# EAGLE design Relay_Board_V2 (EAGLE 7.7.0)
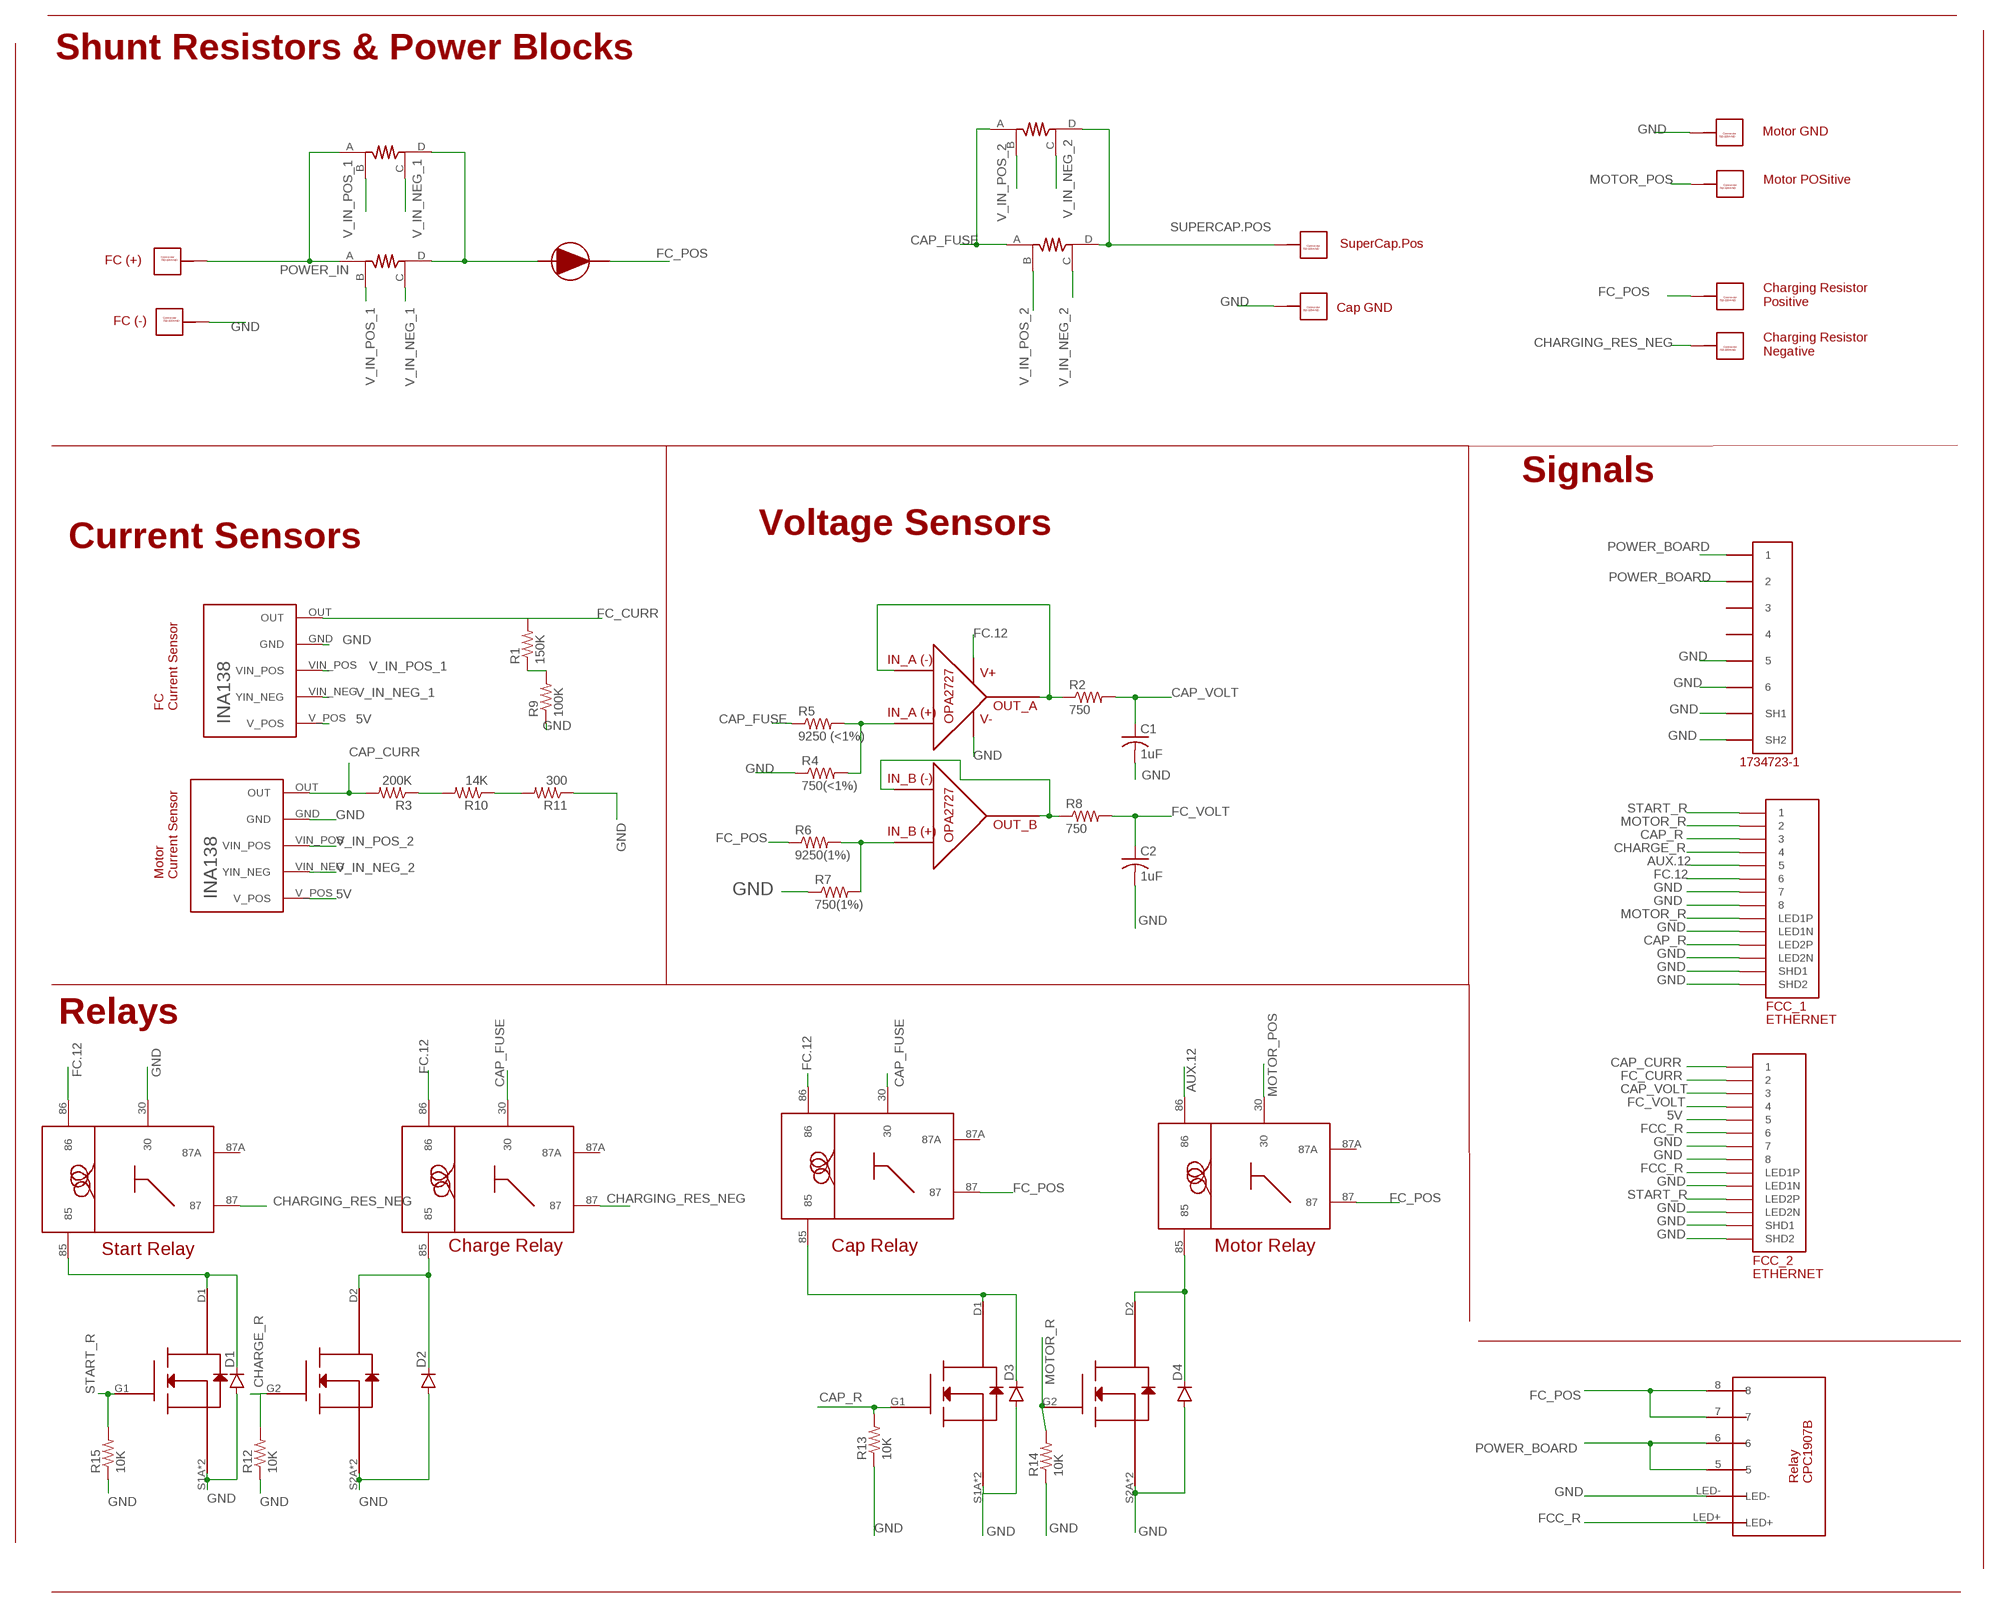
[diagram p0: schematic, sheet 1]

## Parts
C1  1uF  C-USC0805  [C0805]
C2  1uF  C-USC0805  [C0805]
CAP.GND  732-3204-ND_CONNECTOR  [732-3204-ND]
CAP.POS  732-3204-ND_CONNECTOR  [732-3204-ND]
CAP.RELAY  VCF4-1000  [VCF4-1000]
CAP.SHUNT.1  SHUNT_RESISTOR_CSM3637  [CSM3637]
CAP.SHUNT.2  SHUNT_RESISTOR_CSM3637  [CSM3637]
CHARGE_RELAY  VCF4-1000  [VCF4-1000]
D1  DIODESOD123  [SOD-123]
D2  DIODESOD123  [SOD-123]
D3  DIODESOD123  [SOD-123]
D4  DIODESOD123  [SOD-123]
FC.CURR.SENSOR  TI_INA138  [TI_INA138]
FC.GND  732-3204-ND_CONNECTOR  [732-3204-ND]
FC.POS  732-3204-ND_CONNECTOR  [732-3204-ND]
FC.SHUNT.1  SHUNT_RESISTOR_CSM3637  [CSM3637]
FC.SHUNT.2  SHUNT_RESISTOR_CSM3637  [CSM3637]
FC_DIODE  DIODE-APT60S20BG  [DIODE-APT60S20BG]
FCC_1  ETHERNET  [A122645-ND]
FCC_2  ETHERNET  [A122645-ND]
MOTOR.CURR.SENSOR  TI_INA138  [TI_INA138]
MOTOR.GROUND  732-3204-ND_CONNECTOR  [732-3204-ND]
MOTOR.POSITIVE  732-3204-ND_CONNECTOR  [732-3204-ND]
MOTOR.RELAY  VCF4-1000  [VCF4-1000]
R1  150K  R-US_R0805  [R0805]
R2  750  R-US_R0805  [R0805]
R3  200K  R-US_R0805  [R0805]
R4  750(<1%)  R-US_R0805  [R0805]
R5  9250 (<1%)  R-US_R0805  [R0805]
R6  9250(1%)  R-US_R0805  [R0805]
R7  750(1%)  R-US_R0805  [R0805]
R8  750  R-US_R0805  [R0805]
R9  100K  R-US_R0805  [R0805]
R10  14K  R-US_R0805  [R0805]
R11  300  R-US_R0805  [R0805]
R12  10K  R-US_R0805  [R0805]
R13  10K  R-US_R0805  [R0805]
R14  10K  R-US_R0805  [R0805]
R15  10K  R-US_R0805  [R0805]
RES.NEG  732-3204-ND_CONNECTOR  [732-3204-ND]
RES.POS  732-3204-ND_CONNECTOR  [732-3204-ND]
START.RELAY  VCF4-1000  [VCF4-1000]
U$9  SI6926ADQ-T1-E3CT-ND_MOSFET  [SI6926ADQ-T1-E3CT-ND_MOSFET]
U$17  OP-AMP_OPA2727AIDR  [OP-AMP_OPA2727AIDR]
U$19  5555140-6  [1734723-1_RJ11]
U$22  RELAY-CPC1907B  [RELAY-CPC1907B]
U$25  SI6926ADQ-T1-E3CT-ND_MOSFET  [SI6926ADQ-T1-E3CT-ND_MOSFET]

## Nets
5V: FC.CURR.SENSOR.V_POS FCC_2.P$5 MOTOR.CURR.SENSOR.V_POS
AUX.12: FCC_1.P$5 MOTOR.RELAY.86
CAP_CURR: FCC_2.P$1 MOTOR.CURR.SENSOR.OUT R3.2
CAP_FUSE: CAP.RELAY.30 CAP.SHUNT.1.A CAP.SHUNT.2.A CHARGE_RELAY.30 R5.1
CAP_R: FCC_1.P$3 FCC_1.P$12(LED2P) R13.2 U$9.G1
CAP_VOLT: C1.1 FCC_2.P$3 R2.2
CHARGE_R: FCC_1.P$4 R12.2 U$25.G2
CHARGING_RES_NEG: CHARGE_RELAY.87 RES.NEG.P$1 RES.NEG.P$2 RES.NEG.P$3 RES.NEG.P$4 RES.NEG.P$5 RES.NEG.P$6 RES.NEG.P$7 RES.NEG.P$8 RES.NEG.P$9 RES.NEG.P$10 START.RELAY.87
FC.12: CAP.RELAY.86 CHARGE_RELAY.86 FCC_1.P$6 START.RELAY.86 U$17.V+
FC_CURR: FC.CURR.SENSOR.OUT FCC_2.P$2 R1.2
FC_POS: CAP.RELAY.87 FC_DIODE.CATHODE MOTOR.RELAY.87 R6.1 RES.POS.P$1 RES.POS.P$2 RES.POS.P$3 RES.POS.P$4 RES.POS.P$5 RES.POS.P$6 RES.POS.P$7 RES.POS.P$8 RES.POS.P$9 RES.POS.P$10 U$22.7 U$22.8
FC_VOLT: C2.1 FCC_2.P$4 R8.2
FCC_R: FCC_2.P$6 FCC_2.P$10(LED1P) U$22.LED+
GND: C1.2 C2.2 CAP.GND.P$1 CAP.GND.P$2 CAP.GND.P$3 CAP.GND.P$4 CAP.GND.P$5 CAP.GND.P$6 CAP.GND.P$7 CAP.GND.P$8 CAP.GND.P$9 CAP.GND.P$10 D1.A D2.A D3.A D4.A FC.CURR.SENSOR.GND FC.GND.P$1 FC.GND.P$2 FC.GND.P$3 FC.GND.P$4 FC.GND.P$5 FC.GND.P$6 FC.GND.P$7 FC.GND.P$8 FC.GND.P$9 FC.GND.P$10 FCC_1.P$7 FCC_1.P$8 FCC_1.P$9(LED1N) FCC_1.P$11(LED2N) FCC_1.P$13(SHD1) FCC_1.P$14(SHD2) FCC_2.P$7 FCC_2.P$8 FCC_2.P$9(LED1N) FCC_2.P$11(LED2N) FCC_2.P$13(SHD1) FCC_2.P$14(SHD2) MOTOR.CURR.SENSOR.GND MOTOR.GROUND.P$1 MOTOR.GROUND.P$2 MOTOR.GROUND.P$3 MOTOR.GROUND.P$4 MOTOR.GROUND.P$5 MOTOR.GROUND.P$6 MOTOR.GROUND.P$7 MOTOR.GROUND.P$8 MOTOR.GROUND.P$9 MOTOR.GROUND.P$10 R4.1 R7.1 R9.1 R11.1 R12.1 R13.1 R14.1 R15.1 START.RELAY.30 U$9.S1A(S1) U$9.S1B(S1) U$9.S2A(S2) U$9.S2B(S2) U$17.V- U$19.5 U$19.6 U$19.SH1 U$19.SH2 U$22.LED- U$25.S1A(S1) U$25.S1B(S1) U$25.S2A(S2) U$25.S2B(S2)
MOTOR_POS: MOTOR.POSITIVE.P$1 MOTOR.POSITIVE.P$2 MOTOR.POSITIVE.P$3 MOTOR.POSITIVE.P$4 MOTOR.POSITIVE.P$5 MOTOR.POSITIVE.P$6 MOTOR.POSITIVE.P$7 MOTOR.POSITIVE.P$8 MOTOR.POSITIVE.P$9 MOTOR.POSITIVE.P$10 MOTOR.RELAY.30
MOTOR_R: FCC_1.P$2 FCC_1.P$10(LED1P) R14.2 U$9.G2
N$1: R1.1 R9.2
N$3: CAP.RELAY.85 D3.C U$9.D1
N$5: D1.C START.RELAY.85 U$25.D1
N$7: CHARGE_RELAY.85 D2.C U$25.D2
N$9: R4.2 R5.2 U$17.IN_A+
N$10: R6.2 R7.2 U$17.IN_B+
N$11: R8.1 U$17.IN_B- U$17.OUT_B
N$12: R2.1 U$17.IN_A- U$17.OUT_A
N$25: R3.1 R10.2
N$26: R10.1 R11.2
N$29: D4.C MOTOR.RELAY.85 U$9.D2
POWER_BOARD: U$19.1 U$19.2 U$22.5 U$22.6
POWER_IN: FC.POS.P$1 FC.POS.P$2 FC.POS.P$3 FC.POS.P$4 FC.POS.P$5 FC.POS.P$6 FC.POS.P$7 FC.POS.P$8 FC.POS.P$9 FC.POS.P$10 FC.SHUNT.1.A FC.SHUNT.2.A
SHUNT_RES_1: FC.SHUNT.1.D FC.SHUNT.2.D FC_DIODE.ANODE
START_R: FCC_1.P$1 FCC_2.P$12(LED2P) R15.2 U$25.G1
SUPERCAP.POS: CAP.POS.P$1 CAP.POS.P$2 CAP.POS.P$3 CAP.POS.P$4 CAP.POS.P$5 CAP.POS.P$6 CAP.POS.P$7 CAP.POS.P$8 CAP.POS.P$9 CAP.POS.P$10 CAP.SHUNT.1.D CAP.SHUNT.2.D
V_IN_NEG_1: FC.CURR.SENSOR.VIN_NEG(YIN_NEG) FC.SHUNT.1.C FC.SHUNT.2.C
V_IN_NEG_2: CAP.SHUNT.1.C CAP.SHUNT.2.C MOTOR.CURR.SENSOR.VIN_NEG(YIN_NEG)
V_IN_POS_1: FC.CURR.SENSOR.VIN_POS FC.SHUNT.1.B FC.SHUNT.2.B
V_IN_POS_2: CAP.SHUNT.1.B CAP.SHUNT.2.B MOTOR.CURR.SENSOR.VIN_POS
Unconnected: CAP.RELAY.87A CHARGE_RELAY.87A MOTOR.RELAY.87A START.RELAY.87A U$19.3 U$19.4

## Notes on the sheet
- Shunt Resistors & Power Blocks
- Motor GND
- Motor POSitive
- SuperCap.Pos
- FC (+)
- Cap GND
- Charging Resistor
  Positive
- FC (-)
- Charging Resistor
  Negative
- Signals
- Voltage Sensors
- Current Sensors
- FC
  Current Sensor
- Motor
  Current Sensor
- Relays
- Start Relay | Charge Relay | Cap Relay | Motor Relay

## Library data of the parts
C1 C2 = rcl:C-US: CAPACITOR, American symbol
CAP.GND CAP.POS FC.GND FC.POS MOTOR.GROUND MOTOR.POSITIVE RES.NEG RES.POS = Connector 732-3204:732-3204-ND_CONNECTOR
CAP.RELAY CHARGE_RELAY MOTOR.RELAY START.RELAY = VCF4-1000:VCF4-1000: Part for the VCF4-1000 relay socket. Digi-Key Part Number: PB232-ND. Pin numbering is directly taken from the data sheet of the relay. Relay Digi-Key Part Number: 255-2083-ND (Also works with 255-1825-ND). If using relay 255-1825-ND, ignore pin 87A.
CAP.SHUNT.1 CAP.SHUNT.2 FC.SHUNT.1 FC.SHUNT.2 = Vishay_Shunt_Resistor_CSM3637:SHUNT_RESISTOR_CSM3637: Vishay Shunt Resistor CSM3637, 2-200 mOmh's Digikey Number: Y1488-.002BTR-ND; RESISTANCE: 2 - 200 mOhm's
D1-D4 = SparkFun-DiscreteSemi:DIODE: Diode These are standard reverse protection diodes and small signal diodes. SMA package can handle up to about 1A. SOD-323 can handle about 200mA. What the SOD-323 package when ordering, there are some mfgs out there that are 5-pin packages.
FC.CURR.SENSOR MOTOR.CURR.SENSOR = TI_INA138:TI_INA138: Texas Instruments INA138. Datasheet: http://www.ti.com/lit/ds/symlink/ina138.pdf
FC_DIODE = Diode_APT60S20BG-ND:DIODE-APT60S20BG
FCC_1 FCC_2 = ETHERNET-3:ETHERNET: Ethernet port with 2 leds. digikey number A122645-ND
R1-R15 = resistor:R-US_: RESISTOR, American symbol
U$9 U$25 = MOSFET Si6926ADQ:SI6926ADQ-T1-E3CT-ND_MOSFET
U$17 = OP_AMP_OPA2727AIDR:OP-AMP_OPA2727AIDR
U$19 = 5555140-6 RJ11:5555140-6
U$22 = Relay_CPC1907B:RELAY-CPC1907B

## Board
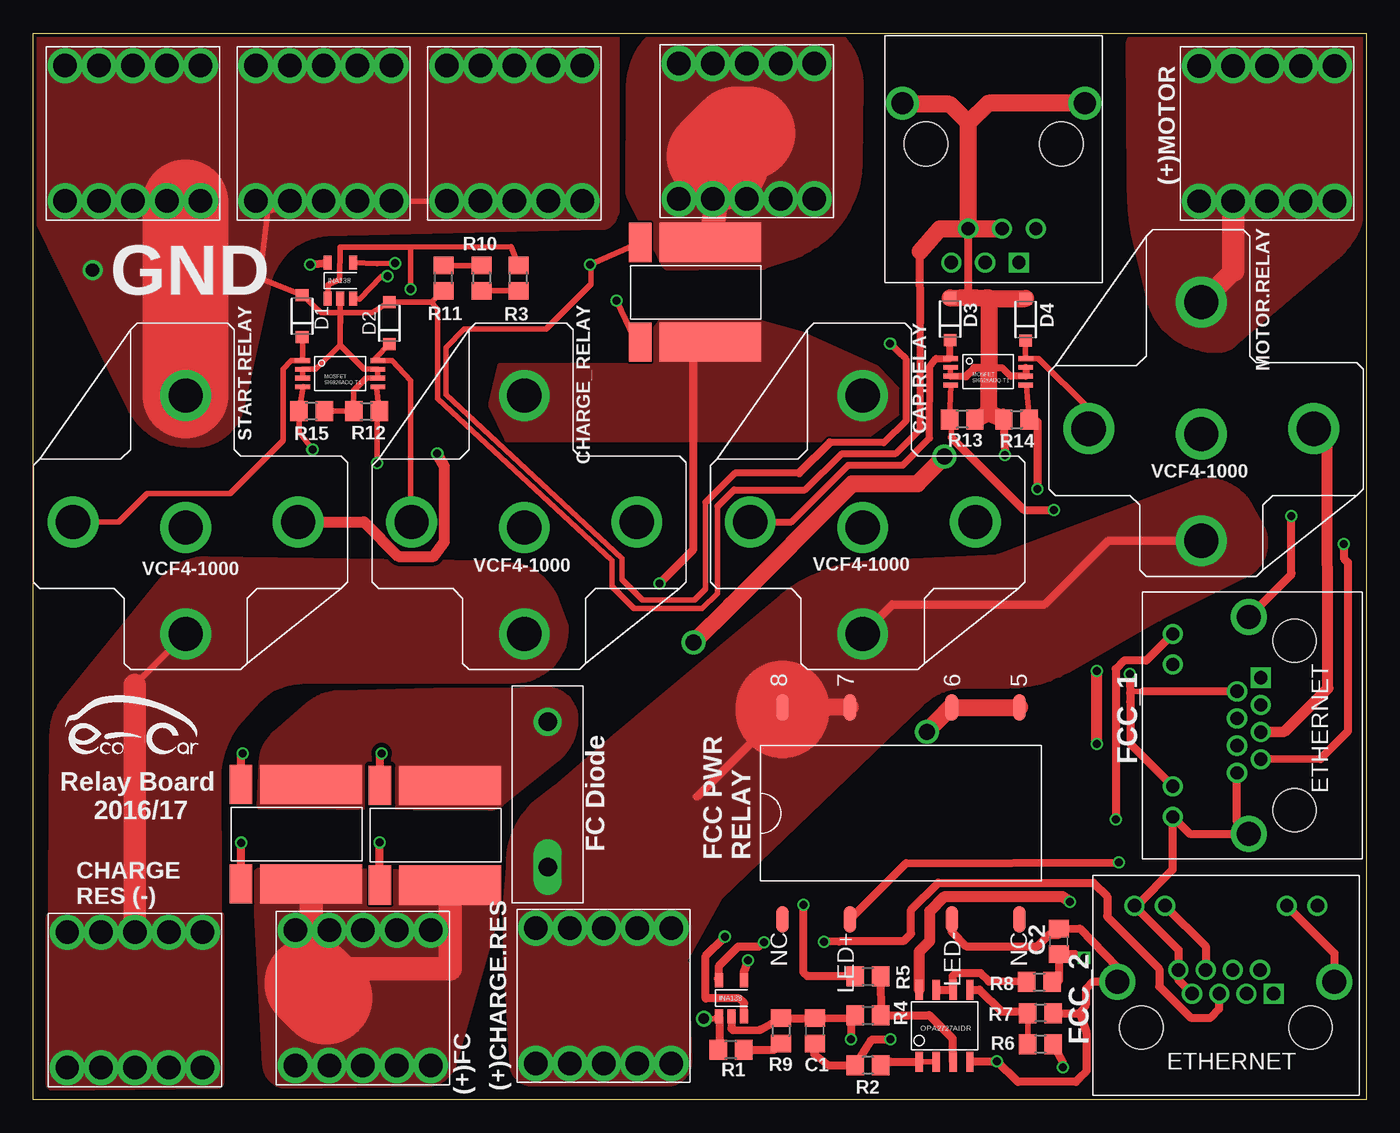
[diagram p1: board, top side]
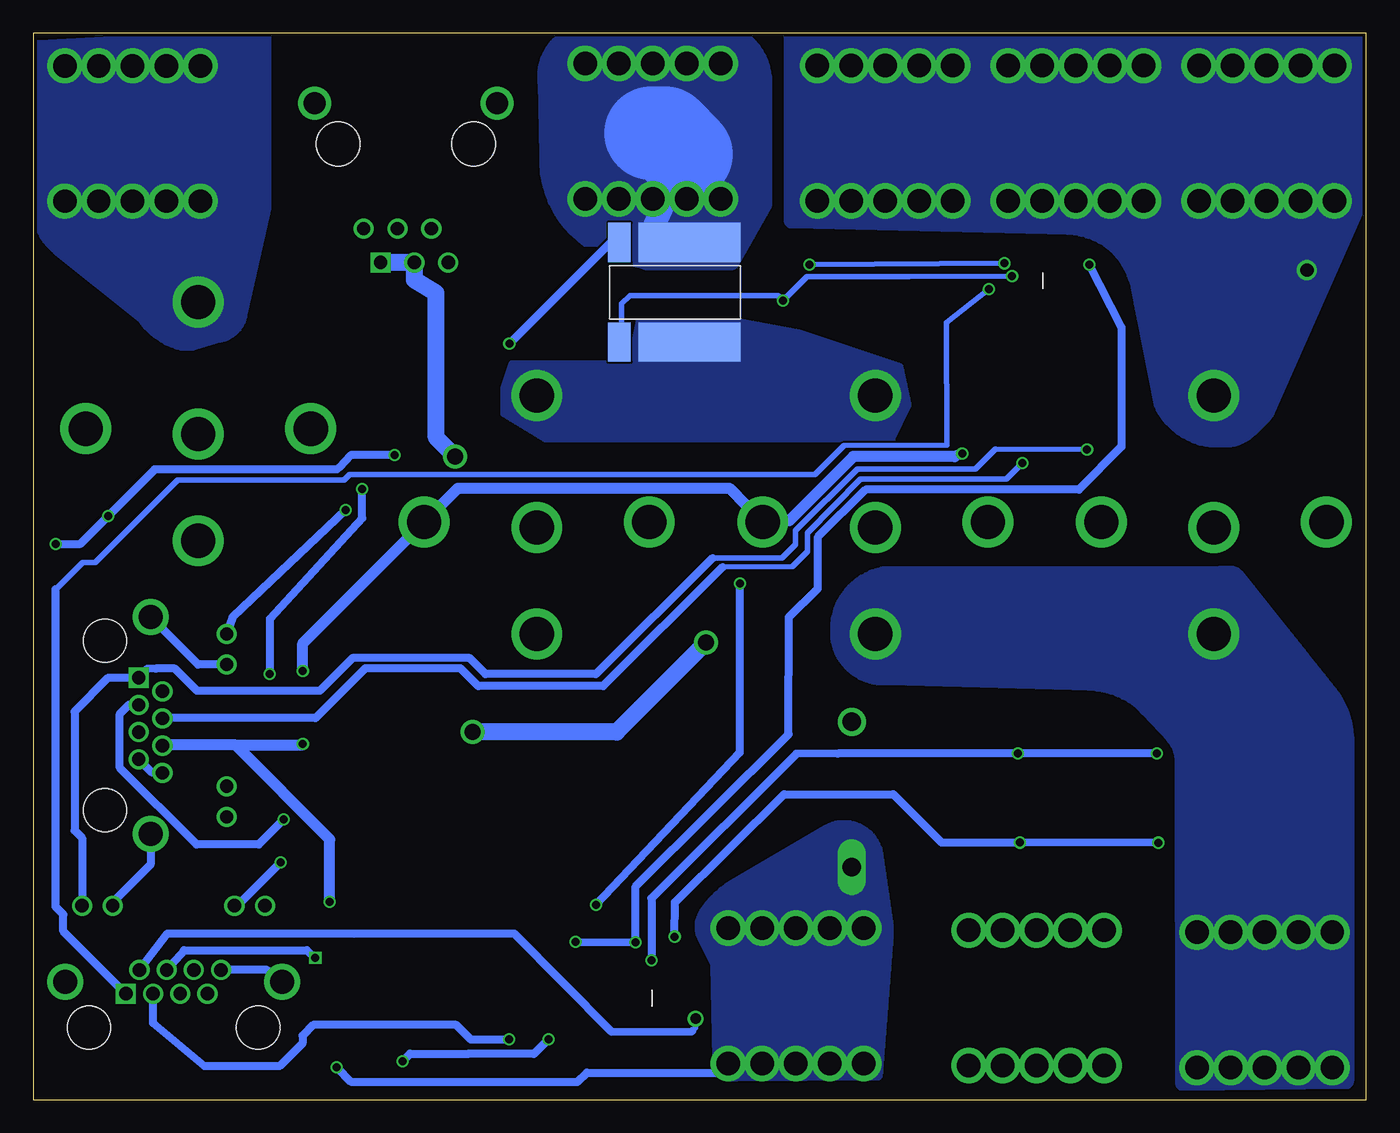
[diagram p2: board, bottom side, seen from below]

Size 100 x 80 mm. Coordinates in mm from the lower left corner, seen from the top.
Outline: 0,0 0,80 100,80 100,0 0,0
Copper layers (1*16): Top 0.035mm / dielectric 1.5mm / Bottom 0.035mm
Design rules "SeeedStudio_2layer_DRU_no_angle_20140221": minimum track width 6mil, minimum drill 12mil, track to track 6mil, track to pad 6mil, pad to pad 6mil, via to via 6mil, smd to smd 0mil, copper to edge 10mil, drill to drill 10mil, minimum pad ring 10mil, minimum via ring 6mil, stop-mask expansion 2mil, vias tented up to drill 100mil, thermal gap 10mil

### Footprints (pad centres in the part's own frame; a part is rotated, then mirrored left to right if it is on the bottom)
C0805 = smd 1.3 x 1.5: 1 -0.95,0; 2 0.95,0
732-3204-ND = drill 1.76: P$1 -5.08,5.08; P$2 -2.54,5.08; P$3 0,5.08; P$4 2.54,5.08; P$5 5.08,5.08; P$6 5.08,-5.08; P$7 2.54,-5.08; P$8 0,-5.08; P$9 -2.54,-5.08; P$10 -5.08,-5.08
VCF4-1000 = drill 2.57 pad 3.81: 30 -17.9,0; 85 -8.407,-8.445; 86 -8.407,8.445; 87 0,0; 87A -8,0
CSM3637 = smd 2.95 x 7.62: A -3.735,0; D 3.735,0 | smd 2.95 x 1.68: B -3.735,5.26; C 3.735,5.26
SOD-123 = smd 0.9 x 0.95: A 1.575,0; C -1.575,0
TI_INA138 = smd 1.05 x 0.6: GND 0,0; OUT 0,0.95; V_POS 2.7,0.95; VIN_NEG 2.7,-0.95; VIN_POS 0,-0.95
DIODE-APT60S20BG = drill 1.4: ANODE 5.45,0 | drill 1.4 long: CATHODE -5.45,0
A122645-ND = drill 1 square: P$1 3.58,2.54 | drill 1: P$2 2.56,4.32; P$3 1.54,2.54; P$4 0.52,4.32; P$5 -0.5,2.54; P$6 -1.52,4.32; P$7 -2.54,2.54; P$8 -3.56,4.32; P$9 -6.86,9.14; P$10 -4.57,9.14; P$11 4.57,9.14; P$12 6.86,9.14 | drill 1.8: P$13 -8.13,3.43; P$14 8.13,3.43 | hole 3.25: -6.35,0; 6.35,0
R0805 = smd 1.3 x 1.5: 1 -0.95,0; 2 0.95,0
SI6926ADQ-T1-E3CT-ND_MOSFET = smd 1.1 x 0.356: D1 -2.82,0.992; D2 2.82,0.992; G1 -2.82,-0.992; G2 2.82,-0.992; S1A -2.82,0.331; S1B -2.82,-0.331; S2A 2.82,0.331; S2B 2.82,-0.331
OP-AMP_OPA2727AIDR = smd 1.5 x 0.55: IN_A+ -2.7,-0.635; IN_A- -2.7,0.635; IN_B+ 2.7,-1.905; IN_B- 2.7,-0.635; OUT_A -2.7,1.905; OUT_B 2.7,0.635; V+ 2.7,1.905; V- -2.7,-1.905
1734723-1_RJ11 = drill 1 square: 1 -2.54,2.54 | drill 1: 2 0,2.54; 3 2.54,2.54; 4 -3.81,0; 5 -1.27,0; 6 1.27,0 | drill 1.65: SH1 -7.5,-9.4; SH2 6.22,-9.4 | hole 3.3: -5.72,-6.35; 4.44,-6.35
RELAY-CPC1907B = smd 2 x 0.95: 5 7.95,-8.891; 6 7.95,-3.809; 7 7.95,3.811; 8 7.95,8.891; LED+ -7.95,3.811; LED- -7.95,-3.811; NC_1 -7.95,8.891; NC_2 -7.95,-8.891

### Placement (x,y rotation side)
C1  58.63,5.16 90 top
C2  76.93,11.86 90 top
CAP.GND  21.78,72.5 0 top
CAP.POS  53.52,72.65 0 top
CAP.RELAY  62.23,34.92 270 top
CAP.SHUNT.1  50.8,60.57 90 top
CAP.SHUNT.2  50.77,60.57 90 bottom
CHARGE_RELAY  36.83,34.92 270 top
D1  20.17,58.77 90 top
D2  26.71,58.24 90 top
D3  68.79,58.56 90 top
D4  74.44,58.52 90 top
FC.CURR.SENSOR  52.38,6.24 90 top
FC.GND  7.47,72.5 0 top
FC.POS  24.74,7.62 0 top
FC.SHUNT.1  31.27,19.83 90 top
FC.SHUNT.2  20.85,19.91 90 top
FC_DIODE  38.59,22.89 90 top
FCC_1  94.63,28.07 90 top
FCC_2  89.48,5.4 0 top
MOTOR.CURR.SENSOR  23.03,60.08 90 top
MOTOR.GROUND  36.09,72.5 0 top
MOTOR.POSITIVE  92.55,72.49 0 top
MOTOR.RELAY  87.63,41.93 270 top
R1  52.34,3.72 180 top
R2  62.62,2.57 180 top
R3  36.39,61.64 90 top
R4  62.62,6.33 0 top
R5  62.62,9.24 0 top
R6  75.55,4.15 180 top
R7  75.55,6.49 180 top
R8  75.48,8.82 0 top
R9  56.09,5.16 270 top
R10  33.62,61.64 270 top
R11  30.77,61.64 90 top
R12  25,51.64 0 top
R13  69.7,51.04 180 top
R14  73.76,51.03 0 top
R15  20.88,51.64 180 top
RES.NEG  7.62,7.47 0 top
RES.POS  42.78,7.78 0 top
START.RELAY  11.43,34.92 270 top
U$9  71.64,54.61 0 top
U$16  [LOGO]  7.78,27.71 0 top
U$17  68.37,5.54 90 top
U$19  71.41,65.34 180 top
U$22  65.09,21.48 90 top
U$25  23.03,54.46 0 top

### Tracks (layer width: path | path; a pad name or v marks a point on that pad's centre or on a via)
5V  (via drill 0.6)
  Top 0.406: 51.27,9.1 51.4,8.97 FC.CURR.SENSOR.V_POS | 80.57,13.75 80.59,13.69
  Top 0.61: 51.4,8.97 51.41,9.98 52.88,11.47 54.42,11.47 v54.83,11.79 | FCC_2.P$5 88.98,6.79 88.33,6.14 86.84,6.14 84.48,8.49 84.48,9.8 80.59,13.69 | 80.57,13.75 80.57,15.24 79.54,16.27 67.9,16.27 65.85,14.22 65.85,12.44 65.28,11.87 60.48,11.86 v59.31,11.84 | v20.78,62.66 MOTOR.CURR.SENSOR.V_POS
  Bottom 0.61: v20.78,62.66 18.35,57.94 18.35,48.99 21.55,45.77 37.56,45.77 41.12,42.24 41.14,38.33 43.31,36.2 43.33,27.41 54.81,15.98 v54.83,11.79 v59.31,11.84
AUX.12
  Top 0.406: FCC_1.P$5 92.5,27.57
  Top 0.813: FCC_1.P$5 93.88,27.62 97.12,30.86 97.08,49.2 MOTOR.RELAY.86
CAP_CURR  (via drill 0.6)
  Top 0.406: R3.2 35.84,63.98 28.31,63.96 | MOTOR.CURR.SENSOR.OUT 22.11,61.14 22.98,61.53 23,63.95 28.31,63.96 | 28.31,63.96 v28.31,60.8
  Bottom 0.406: 98.32,38.27 96.3,40.29 95.37,40.29 89.19,46.48 89.19,46.5 76.67,46.5 76.28,46.89 74.49,46.89 74.03,46.9 41.35,46.91 39.18,49.08 31.46,49.09 31.49,58.28 v28.31,60.8
  Bottom 0.61: 98.32,38.27 98.32,14.47 97.74,13.88 97.74,12.62 FCC_2.P$1
CAP_FUSE  (via drill 0.6)
  Top 0.406: 49.53,55.57 CAP.SHUNT.1.A
  Top 0.61: R5.1 58.07,9.24 57.78,9.53 v57.78,14.61 | v46.99,38.73 49.53,41.27 49.53,55.57
  Bottom 0.61: v57.78,14.61 46.99,26.04 v46.99,38.73
  pour Bottom (no thermals): 46.99,58.42 42.57,57.58 34.95,55.04 34.29,52.07 35.56,49.53 61.59,49.53 64.77,51.44 64.77,53.34 64.14,55.24 55.24,55.24 54.61,58.42
  pour Top (no thermals): 54.46,58.34 57.56,57.48 63.3,54.86 64.77,53.34 64.77,51.44 62.23,49.53 35.56,49.53 34.29,52.07 35.03,55.07 44.55,55.07 47.07,58.32
CAP_R  (via drill 0.6)
  Top 0.406: U$9.G1 68.85,53.59 R13.2 68.89,51.62 68.89,49.69
  Top 0.61: v76.57,44.24 74.33,44.24 68.89,49.69 | FCC_1.P$12 83.5,32.93 81.83,32.93 81.21,32.31 v81.21,21
  Bottom 0.61: v76.57,44.24 85.05,36.2 FCC_1.P$12 | v81.21,21 83.08,19.14 87.74,19.14 93.5,24.89 93.5,28.94 92.83,29.61 FCC_1.P$3
CAP_VOLT  (via drill 0.6)
  Top 0.61: C1.1 58.59,3.41 59.65,2.57 R2.2 62.93,4.51 v64.32,4.51
  Bottom 0.61: FCC_2.P$3 91.02,5.73 87.16,2.5 81.52,2.5 79.81,4.21 79.81,4.79 79,5.6 68.27,5.6 67.18,4.51 v64.32,4.51
CHARGE_R  (via drill 0.6)
  Top 0.406: U$25.G2 25.75,53.37 R12.2 25.78,51.55 25.78,49.33 v25.78,47.76
  Bottom 0.406: 48.28,39.95 43.05,39.98 41.91,41.12 41.91,42.52 37.93,46.54 27,46.54 v25.78,47.76 | 90.29,28.61 FCC_1.P$4
  Bottom 0.61: 48.28,39.95 57.25,31.02 66.62,31.02 67.95,32.35 75.1,32.35 78.83,28.61 90.29,28.61
CHARGING_RES_NEG
  Top 0.406: START.RELAY.87 7.62,31.12
  Top 1.676: 7.62,31.12 RES.NEG.P$3
  pour Top (no thermals): 13.69,13.69 13.69,1.4 1.56,1.24 1.56,13.54
  pour Top (isolate 0.305, rank 2, no thermals): 39.28,37.29 arc61 36.26,40.08 34.24,40.27 13.03,40.57 arc52 9.6,38.96 2.42,30.14 arc39 1.39,27.27 1.27,10.16 13.97,8.26 13.9,24.15 arc-42 15.57,28.5 16.83,29.89 arc-48 20.09,31.35 36.12,31.41 arc92 39.98,35.48
  pour Bottom (no thermals): 39.58,35.37 arc78 36.2,39.38 10.82,39.44 arc52 9.8,39.28 2.79,30.48 arc39 1.55,26.95 1.55,1.4 13.68,1.24 13.71,25.38 arc-42 14.45,27.27 16.29,29.29 arc-46 20.68,31.29 35.83,31.7 arc101
FC.12  (via drill 0.6)
  Top 0.813: U$17.V+ 66.46,11.1 67.26,11.9 67.26,14.13 68.37,15.24 77.21,15.24 v77.78,14.85 | v79.78,26.67 v79.78,32.15 | START.RELAY.86 24.81,43.33 27.38,40.76 30.04,40.76 30.86,41.86 30.86,47.49 v30.31,48.48
  Bottom 0.406: 90.27,26.59 FCC_1.P$6 | 79.86,26.59 v79.78,26.67 | 45.28,43.35 CHARGE_RELAY.86
  Bottom 0.813: v77.78,14.85 77.76,19.52 84.83,26.59 | 84.83,26.59 90.27,26.59 | 84.83,26.59 79.86,26.59 | v79.78,32.15 79.78,34.23 CAP.RELAY.86 68.13,45.88 47.78,45.88 CHARGE_RELAY.86 | v30.31,48.48 30.89,48.23 38.48,48.25 43.28,43.43 45.28,43.35
FC_CURR  (via drill 0.8)
  Top 0.406: 51.47,6.22 51.47,6.21 51.24,6.21 FC.CURR.SENSOR.OUT 51.25,6.07 v50.31,6.07 | 51.47,4.03 R1.2
  Top 0.61: 51.47,6.22 51.47,4.03
  Bottom 0.406: 89.3,12.46 89.3,12.45 | 50.56,5.13 50.31,5.39 v50.31,6.07
  Bottom 0.61: FCC_2.P$2 89.94,12.46 89.3,12.46 | 89.3,12.45 74.81,12.45 75.92,12.45 63.91,12.45 56.62,5.08 50.56,5.13
FC_POS  (via drill 0.6)
  Top 0.406: 77.23,2.79 v77.23,2.41
  Top 0.61: CAP.RELAY.87 64.45,37.15 75.88,37.15 80.66,41.93 MOTOR.RELAY.87 | R6.1 77.23,2.79 | 56.2,29.13 49.78,22.71
  Top 1.27: U$22.7 U$22.8
  Top 7: U$22.8 56.2,29.13
  Bottom 0.406: 48.54,2.02 RES.POS.P$6
  Bottom 0.61: 48.54,2.02 58.47,2.02 59.17,1.32 70.68,1.32 76.19,1.34 v77.23,2.41
  pour Top (rank 4, no thermals): 48.9,10.16 49.11,2.87 arc-92 47.54,1.24 37.5,1.24 arc-87 36.01,2.65 35.56,10.79 35.56,14.61 35.76,17.42 arc-48 37.62,22.07 39.27,23.35 43.72,27.19 56.24,37.65 arc-37 62.72,40.18 72.39,40.64 86.91,46.12 arc-81 91.14,44.58 92.01,43.03 arc-93 90.89,39.41 84.45,36.2 77.66,32.31 arc-30 73.15,31.11 69.89,31.11 arc44 66.54,29.76 51.44,15.24 48.6,10.12
  pour Bottom (no thermals): 36.61,1.71 47.31,1.64 arc89 48.73,3.01 48.9,10.16 49.82,11.98 arc60 49.7,14.16 arc26 47.49,16.26 40.51,20.33 arc112 36.56,18.42 35.74,12.75
FC_VOLT  (via drill 0.6)
  Top 0.406: 76.93,8.87 R8.2
  Top 0.61: 76.93,8.87 C2.1 78.15,10.93 v78.84,10.63
  Bottom 0.61: FCC_2.P$4 88.68,11.2 79.46,11.2 v78.84,10.63
FCC_R  (via drill 0.6)
  Top 0.61: U$22.LED+ 65.48,17.72 v81.43,17.8 | FCC_2.P$10 87.96,11.49 FCC_2.P$6
  Bottom 0.406: 84.71,14.54 FCC_2.P$10
  Bottom 0.61: v81.43,17.8 84.71,14.54
GND  (via drill 0.6, 1)
  Top 0.406: MOTOR.CURR.SENSOR.GND 23.02,60.09 23.02,59.48 | 23.02,58.32 23.05,58.3 23.02,59.48 | R12.1 24.05,53.21 24.96,54.12 25.84,54.12 U$25.S2B U$25.S2A 24.83,54.79 23.02,56.61 | U$25.S1B U$25.S1A 21.2,54.79 23.02,56.61 | 23.02,56.61 23.02,58.32 | 23.02,58.32 23.02,59.05 | 23.02,59.05 23.02,59.48 | MOTOR.GROUND.P$10 20.3,67.42 17.6,66.62 16.96,61.65 D1.A 21.59,59.05 23.02,59.05 | 24.03,51.56 R12.1 | U$9.S1A U$9.S1B | 72.79,51.67 R14.1 72.81,50.35 | 71.67,51.51 71.69,51.55 | U$9.S2B | 58.68,6.1 C1.2 | 61.47,6.12 R4.1 61.35,6.2 | R7.1 78.51,6.51 | 81.47,8.86 FCC_2.P$13 | 76.96,12.36 C2.2 | v72.31,2.87 72.04,2.82 | 52.38,5.32 52.48,5.21 | 82.78,14.54 FCC_2.P$9 | 51.34,44.49 51.34,37.99 50.18,36.83 45.09,36.83 43.41,38.51 43.41,40.45 30.34,52.58 30.34,59.32 29.84,59.82 | 70.16,65.34 U$19.6 | 71.49,60.13 71.69,60.13 71.72,60.1 | 65.19,74.68 U$19.SH2 | 94.39,39.5 94.34,39.34 | R15.1 R12.1 | 23.02,59.05 25.4,59.05 D2.A 29.84,59.82 | 29.84,59.82 29.9,59.82 R11.1 | 78.53,1.63
  Top 0.508: U$9.S2A U$9.S2B | U$9.S1B 69.98,54.27 | U$9.S2B 73.32,54.27 72.7,54.9 71.69,54.9 | 51.34,44.49 52.58,45.74 57.89,45.74 60.68,48.46 64.72,48.48 66.55,50.29 66.55,58.32
  Top 0.61: 69.98,54.27 70.6,54.9 71.69,54.9 | 52.48,5.21 54.55,5.24 R9.1 58.68,6.1 | C1.2 61.47,6.12 | 78.51,6.51 79,5.03 79,2.1 78.53,1.63 78.22,1.32 73.87,1.32 v72.31,2.87 | R7.1 78.51,6.46 79,7.15 79,8.32 79.54,8.86 81.47,8.86 | U$22.LED- 68.9,12.59 69.98,11.51 75.34,11.51 76.2,12.36 76.96,12.36 | 72.04,2.82 U$17.V- | C2.2 78.51,12.82 81.35,9.94 FCC_2.P$13 | 72.81,50.35 v72.88,48.36 | FCC_1.P$14 94.34,39.34 | 94.39,39.5 v94.39,43.78 | FC.CURR.SENSOR.GND 52.38,5.32 | FCC_1.P$7 96.57,25.55 98.64,27.63 98.64,40.29 98.32,40.6 v98.32,41.69 | FCC_1.P$8 90.31,20.83 FCC_1.P$13 86.76,19.94 FCC_1.P$9 85.49,17.26 82.78,14.54 | FCC_2.P$11 97.61,10.98 FCC_2.P$14 | FCC_2.P$9 85.92,11.24 FCC_2.P$8 85.92,8.96 FCC_2.P$7 | 61.35,6.2 v61.35,4.51 | 70.14,60.22 U$19.6 | 66.55,58.32 66.52,63.63
  Top 1.27: R13.1 71.69,51.55 71.69,54.9 71.69,60.13 | R14.1 71.67,51.51 | D3.A 70.14,60.22 71.49,60.13 | U$19.5 70.16,65.34 70.16,73.28 | 71.72,60.1 D4.A | 66.52,63.63 68,65.34 U$19.6 | 70.16,73.28 68.76,74.68 65.19,74.68 | U$19.SH1 71.65,74.75 70.16,73.28
  Top 6.452: START.RELAY.30 11.43,67.31
  Bottom 0.406: 77.06,47.43 | 77.06,47.43 77.21,47.27 | 94.05,14.78 FCC_2.P$11
  Bottom 0.61: FCC_2.P$13 82.47,9.72 FCC_2.P$8 | FCC_1.P$8 91.07,24.51 FCC_1.P$7 | FCC_1.P$13 91.2,17.63 94.05,14.78 | v72.31,2.87 71.73,3.45 69.27,3.42 67.42,3.42 62.44,3.42 v61.35,4.51 | FCC_1.P$11 87.64,32.64 FCC_1.P$14 | v72.88,48.36 76.18,48.36 77.06,47.43 | 77.21,47.27 90.9,47.27 v94.39,43.78 96.48,41.69 v98.32,41.69
  other vias: 4.45,62.23
  pour Top (no thermals): 43.21,66.43 arc-86 42.64,65.87 21.97,65.39 arc77 17.15,61.01 15.19,51.96 arc-77 12.1,49.53 11.68,49.53 arc-64 7.65,52.03 0.13,67.23 -1.77,81.11 43.35,80.7 43.35,66.66
  pour Bottom (no thermals): 43.05,65.96 43.05,82.38 -0.89,80.47 -2.79,68.34 arc-131 0.16,68.29 7.62,51.44 8.69,50.36 arc45 10.7,49.53 11.13,49.53 arc63 15.24,52.07 17.03,61.02 arc-77 22.36,65.49
MOTOR_POS
  Top 1.422: MOTOR.RELAY.30 90.01,62.21
  Top 1.676: 90.01,62.21 MOTOR.POSITIVE.P$9
  pour Top (no thermals): 99.41,79.19 99.41,67.77 arc-53 97.2,63.29 89.62,56.86 arc-48 87.79,56.75 arc-74 84.04,60.71 83.23,64.03 arc-13 82.66,68.63 82.61,79.3
  pour Bottom (no thermals): 91.64,58.81 98.13,64.01 arc50 99.36,66.52 99.56,78.87 82.78,79.77 82.78,67.01 84.54,59.14 arc77 86.09,57.41 88.33,56.7 arc48
MOTOR_R  (via drill 0.6)
  Top 0.406: U$9.G2 74.51,53.57 R14.2 75.34,50.85 | 83.25,30.63 82.44,30.63 82.3,30.49
  Top 0.61: 75.34,50.85 v75.34,45.8 | FCC_1.P$2 83.25,30.63 | 82.3,30.49 82.3,29.84 | 82.3,29.84 82.3,26.69 FCC_1.P$10 | v82.27,31.92 82.3,29.84
  Bottom 0.61: v82.27,31.92 82.27,36.07 75.33,43.61 v75.34,45.8
N$1
  Top 0.61: R1.1 55.54,3.73 R9.2
N$3
  Top 0.406: U$9.D1 68.79,55.6
  Top 0.508: CAP.RELAY.85 56.87,43.33 61.14,47.61 65.23,47.61 67.24,49.62 67.27,54.98 67.72,55.59 U$9.D1 | 68.79,55.6 D3.C
N$5
  Top 0.406: START.RELAY.85 6.4,43.33 8.55,45.49 14.77,45.49 18.74,49.45 18.74,54.82 19.36,55.44 20.2,55.44 U$25.D1 20.21,57.16 D1.C
N$7
  Top 0.406: D2.C 25.67,55.62 U$25.D2 25.85,55.44 26.9,55.44 28.3,53.96 28.3,43.34 CHARGE_RELAY.85
N$9
  Top 0.406: 68.97,2.87 U$17.IN_A+ | 63.59,6.33 R4.2
  Top 0.61: 68.97,2.87 68.97,4.59 67.23,6.33 63.59,6.33 R5.2
N$10
  Top 0.406: R6.2 R7.2 74.15,6.61
  Top 0.61: U$17.IN_B+ 71,8.23 72.62,6.61 74.15,6.61
N$11
  Top 0.406: 68.97,8.27 U$17.IN_B-
  Top 0.61: U$17.OUT_B U$17.IN_B- | R8.1 71.69,8.87 71.07,9.49 69.2,9.49 68.97,9.25 68.97,8.27
N$12
  Top 0.406: U$17.IN_A- U$17.OUT_A 66.42,2.88 | R2.1 64.29,2.83
  Top 0.61: 64.29,2.83 U$17.OUT_A
N$25
  Top 0.406: R10.2 R3.1
N$26
  Top 0.406: R11.2 R10.1
N$29
  Top 0.406: MOTOR.RELAY.85 79.18,51.83 75.42,55.59 U$9.D2 | U$9.D2 | U$9.D2 74.44,55.59 D4.C
POWER_BOARD  (via drill 1.2)
  Top 1.27: U$22.5 U$22.6 68.8,29.4 v67.03,27.56 | v49.53,34.29 52.33,37.08 61.45,46.21 66.33,46.21 67.18,47.08 v68.38,48.26
  Bottom 1.27: v49.53,34.29 56.23,27.56 v67.03,27.56 | v68.38,48.26 69.77,49.69 69.8,60.51 71.41,61.48 U$19.2 U$19.1
POWER_IN
  Top 1.778: FC.SHUNT.2.A 20.85,8.71 | FC.SHUNT.1.A 31.27,9.8 22.71,9.8
  Top 7: 20.85,8.71 21.94,7.62
  pour Top (no thermals): 34.34,13.94 31.19,2.9 arc-73 29.41,1.54 19.09,1.41 arc-88 17.81,2.61 17.07,16.81 34.41,16.59
SHUNT_RES_1
  pour Top (isolate 0.305, rank 3, no thermals): 16.93,22 34.21,21.87 arc40 35.14,22.2 39.28,25.56 arc49 40.7,28.43 arc91 38.43,30.81 35.74,30.86 22.92,30.52 arc40 20.59,29.6 18.17,27.49 arc46 17.1,25.3
START_R  (via drill 0.6)
  Top 0.406: U$25.G1 20.23,53.5 R15.2 19.93,50.06 v20.94,48.77
  Bottom 0.406: v20.94,48.77 27.8,48.8 29.34,47.3 38.19,47.32 42.82,42.7 42.82,41.63 43.84,40.64 49.04,40.63
  Bottom 0.61: 49.04,40.63 57.8,31.93 66.08,31.93 67.25,33.12 76.05,33.12 78.51,30.66 87.72,30.66 89.39,32.33 90.81,32.33 91.46,32.32 FCC_1.P$1 94.37,31.65 96.91,29.11 96.91,20.19 96.34,19.61 FCC_2.P$12
SUPERCAP.POS
  Top 1.778: CAP.SHUNT.1.D 51.66,70.25
  Top 7: 51.66,70.25 51.03,70.79 52.74,72.5 53.67,72.5
  Bottom 1.676: CAP.SHUNT.2.D 53.57,65.2 51.03,70.94
  Bottom 7: 51.03,70.94 52.58,72.5 53.67,72.5
  pour Top (no thermals): 45.09,67.94 45.12,76.02 arc-89 49.96,80.86 56.87,80.89 arc-91 61.64,76.08 61.58,70.25 arc-71 56.75,63.59 54.61,62.87 52.07,62.87 47.77,62.81 arc-64 47.68,62.86
  pour Bottom (no thermals): 45.19,67.18 45.19,76.3 arc-91 49.32,80.37 58.43,80.23 arc-90 61.54,76.34 61.43,70.83 arc-74 56.37,63.52 53.98,62.87 47.62,62.87
V_IN_NEG_1  (via drill 0.6)
  Top 0.406: 26.01,25.85 v26.14,25.98 | 15.59,25.86 v15.71,25.98
  Top 0.61: FC.SHUNT.1.C 26.01,25.85 | v53.63,10.46 53.3,9.51 FC.CURR.SENSOR.VIN_NEG | FC.SHUNT.2.C 15.59,25.86
  Bottom 0.61: v15.71,25.98 v26.14,25.98 39.65,25.96 42.75,25.93 53.63,15.1 v53.63,10.46
V_IN_NEG_2  (via drill 0.6)
  Top 0.406: v41.75,62.65 41.84,62.68 | 41.84,62.68 CAP.SHUNT.1.C | v27.15,62.74 25.79,62.72 MOTOR.CURR.SENSOR.VIN_NEG | 50.44,44.81 50.44,38.3 49.61,37.47 45.72,37.47 44.18,39 44.18,40.6 30.96,52.9 30.96,56.42 32.33,57.82 38.48,57.82 41.85,61.19 41.84,62.68 | CAP.SHUNT.1.C
  Top 0.508: v64.29,56.71 65.46,55.58 65.46,50.9 63.8,49.28 59.77,49.3 | 57.45,47 52.63,47 50.44,44.81
  Top 0.61: 59.77,49.3 57.45,47
  Bottom 0.406: v27.15,62.74 v41.75,62.65
  Bottom 0.61: v64.29,56.71 56.69,64.3 CAP.SHUNT.2.C
V_IN_POS_1  (via drill 0.6)
  Top 0.406: 25.98,16.12 FC.SHUNT.1.B
  Top 0.61: FC.CURR.SENSOR.VIN_POS 53.33,7.25 52.96,7.59 50.44,7.59 50.44,10.77 v51.88,12.22 | FC.SHUNT.2.B v15.59,19.27 | 25.98,16.12 v25.98,19.27
  Bottom 0.61: v51.88,12.22 51.87,14.81 43.68,22.9 35.47,22.9 31.86,19.27 v25.98,19.27 v15.59,19.27
V_IN_POS_2  (via drill 0.6)
  Top 0.406: MOTOR.CURR.SENSOR.VIN_POS 24.47,60.04 26.1,61.73 v26.57,61.78 | CAP.SHUNT.1.B 45.06,57.15 v43.76,59.95
  Bottom 0.406: CAP.SHUNT.2.B 55.85,56.81 55.85,59.72 55.24,60.33 44.14,60.33 v43.76,59.95 41.97,61.74 38.35,61.75 34.29,61.74 v26.57,61.78

### Text on the board
tNames: (+)MOTOR | GND | Relay Board / 2016/17 | FC Diode | FCC PWR / RELAY | CHARGE / RES (-) | (+)CHARGE.RES | (+)FC
tValues: (+)CAP
bValues: GND | GND | GND | (+)MOTOR | CAP + | GND | CHARGE / RES (-) | (+)FC | (+)CHARGE.RES